# EAGLE schematic FORCE2_sketch (EAGLE 9.3.0)
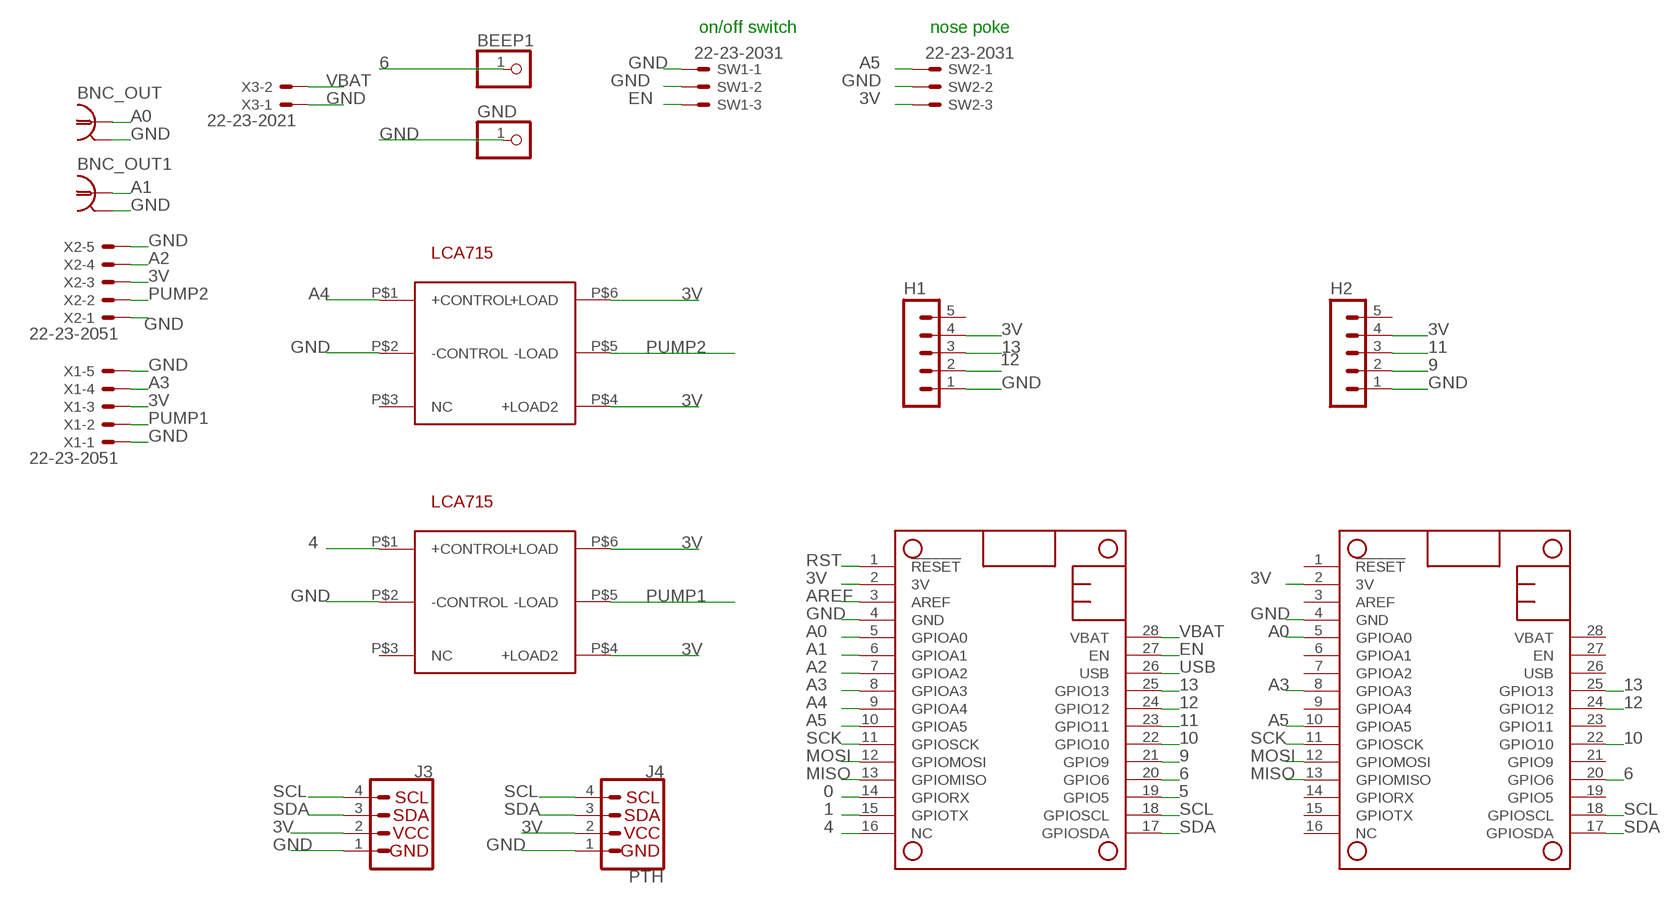
[diagram p0: schematic, sheet 1]

## Parts
BEEP1  PINHD-1X1  [1X01]
BNC_OUT  1-227161-0  [AMP_227161]
BNC_OUT1  1-227161-0  [AMP_227161]
GND  PINHD-1X1  [1X01]
H1  MA05-1  [MA05-1]
H2  MA05-1  [MA05-1]
J3  QWIIC_CONNECTORJS-1MM  [1X04_1MM_RA]
J4  PTH  I2C_STANDARD  [1X04]
MS1  MICROSHIELD_NODIM  [MICROSHIELD_DIM]
MS2  MICROSHIELD_NODIM  [MICROSHIELD_DIM]
SSR2  LCA715S  [LCA7XX]
SSR3  LCA715S  [LCA7XX]
SW1  22-23-2031  [22-23-2031]
SW2  22-23-2031  [22-23-2031]
X1  22-23-2051  [22-23-2051]
X2  22-23-2051  [22-23-2051]
X3  22-23-2021  [22-23-2021]

## Nets
0: MS2.14(GPIORX)
1: MS2.15(GPIOTX)
3V: H1.4 H2.4 J3.2 J4.2 MS1.2(3V) MS2.2(3V) SSR2.P$4(+LOAD2) SSR2.P$6(+LOAD) SSR3.P$4(+LOAD2) SSR3.P$6(+LOAD) SW2.3 X1.3 X2.3
4: MS2.16(NC) SSR2.P$1(+CONTROL)
5: MS2.19(GPIO5)
6: BEEP1.1 MS1.20(GPIO6) MS2.20(GPIO6)
9: H2.2 MS2.21(GPIO9)
10: MS1.22(GPIO10) MS2.22(GPIO10)
11: H2.3 MS2.23(GPIO11)
12: H1.2 MS1.24(GPIO12) MS2.24(GPIO12)
13: H1.3 MS1.25(GPIO13) MS2.25(GPIO13)
A0: BNC_OUT.1 MS1.5(GPIOA0) MS2.5(GPIOA0)
A1: BNC_OUT1.1 MS2.6(GPIOA1)
A2: MS2.7(GPIOA2) X2.4
A3: MS1.8(GPIOA3) MS2.8(GPIOA3) X1.4
A4: MS2.9(GPIOA4) SSR3.P$1(+CONTROL)
A5: MS1.10(GPIOA5) MS2.10(GPIOA5) SW2.1
AREF: MS2.3(AREF)
EN: MS2.27(EN) SW1.3
GND: BNC_OUT1.2 BNC_OUT.2 GND.1 H1.1 H2.1 J3.1 J4.1 MS1.4(GND) MS2.4(GND) SSR2.P$2(-CONTROL) SSR3.P$2(-CONTROL) SW1.1 SW1.2 SW2.2 X1.1 X1.5 X2.1 X2.5 X3.1
MISO: MS1.13(GPIOMISO) MS2.13(GPIOMISO)
MOSI: MS1.12(GPIOMOSI) MS2.12(GPIOMOSI)
PUMP1: SSR2.P$5(-LOAD) X1.2
PUMP2: SSR3.P$5(-LOAD) X2.2
RST: MS2.1(!RESET)
SCK: MS1.11(GPIOSCK) MS2.11(GPIOSCK)
SCL: J3.4 J4.4 MS1.18(GPIOSCL) MS2.18(GPIOSCL)
SDA: J3.3 J4.3 MS1.17(GPIOSDA) MS2.17(GPIOSDA)
USB: MS2.26(USB)
VBAT: MS2.28(VBAT) X3.2
Unconnected: H1.5 H2.5 MS1.1(!RESET) MS1.3(AREF) MS1.6(GPIOA1) MS1.7(GPIOA2) MS1.9(GPIOA4) MS1.14(GPIORX) MS1.15(GPIOTX) MS1.16(NC) MS1.19(GPIO5) MS1.21(GPIO9) MS1.23(GPIO11) MS1.26(USB) MS1.27(EN) MS1.28(VBAT) SSR2.P$3(NC) SSR3.P$3(NC)

## Notes on the sheet
- on/off switch | nose poke

## Library data of the parts
BEEP1 GND = pinhead:PINHD-1X1: PIN HEADER
BNC_OUT BNC_OUT1 = con-coax:?227161*: JACK, RIGHT ANGLE, 50 OHM, PCB, BNC Source: amp_227161.pdf; MF: TYCO ELECTRONICS; MPN: 1-227161; OC_FARNELL: unknown; OC_NEWARK: 33B3200
H1 H2 = con-lstb:MA05-1: PIN HEADER; OC_FARNELL: unknown; OC_NEWARK: unknown
J3 = SparkFun-Connectors:QWIIC_CONNECTOR: SparkFun I2C Standard Qwiic Connector An SMD 1mm pitch JST connector makes it easy and quick (get it? Qwiic?) to connect I2C devices to each other. The Qwiic system <http://www.sparkfun.com/qwiic> enables fast and solderless connection between popular platforms and various sensors and actuators. We carry 200mm <https://www.sparkfun.com/products/14204>, 100mm <https://www.sparkfun.com/products/14205>, 50mm <https://www.sparkfun.com/products/14206>, and breadboard friendly <https://www.sparkfun.com/products/14207> Qwiic cables. We also offer 10 pcs strips <https://www.sparkfun.com/products/14323> the SMD connectors.; PROD_ID: CONN-13694
J4 = SparkFun-Connectors:I2C_STANDARD: SparkFun I2C Standard Pinout Header SparkFun has standardized on a pinout for all I2C based sensor breakouts. This pinout allows I2C boards to be plugged directly into the headers on Arduino Uno compatible boards, and to be daisy chained easily. Example SparkFun Products: SparkFun Atmospheric Sensor Breakout - BME280 <https://www.sparkfun.com/products/13676> SparkFun Altitude/Pressure Sensor Breakout - MPL3115A2 <https://www.sparkfun.com/products/11084> SparkFun TOF Range Finder Sensor - VL6180 <https://www.sparkfun.com/products/12785>
MS1 MS2 = M4:MICROSHIELD
SSR2 SSR3 = Mohamed's-library:LCA715S
SW1 SW2 = con-molex:22-23-2031: .100" (2.54mm) Center Header - 3 Pin; MF: MOLEX; MPN: 22-23-2031; OC_FARNELL: 1462950; OC_NEWARK: 30C0862
X1 X2 = con-molex:22-23-2051: .100" (2.54mm) Center Header - 5 Pin; MF: MOLEX; MPN: 22-23-2051; OC_FARNELL: 1462952; OC_NEWARK: 38C9178
X3 = con-molex:22-23-2021: .100" (2.54mm) Center Header - 2 Pin; MF: MOLEX; MPN: 22-23-2021; OC_FARNELL: 1462926; OC_NEWARK: 25C3832